# EAGLE schematic CC-16-2 ADIS16209 Breakout Board (EAGLE 9.2.2)
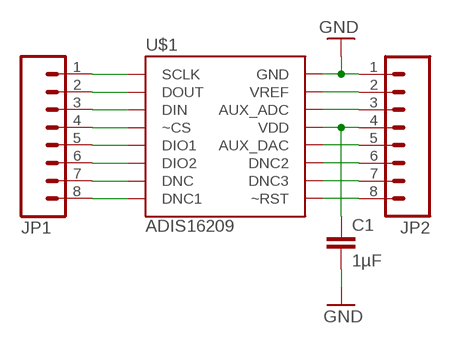
[diagram p0: schematic, sheet 1]

## Parts
C1  1µF  CAP0805  [0805]
JP1  M08  [1X08]
JP2  M08  [1X08]
U$1  ADIS16209  [CC-16-2]

## Nets
GND: C1.2 JP2.1 U$1.P$16(GND)
N$2: JP1.1 U$1.P$1(SCLK)
N$3: JP1.2 U$1.P$2(DOUT)
N$4: JP1.3 U$1.P$3(DIN)
N$5: JP1.4 U$1.P$4(~CS)
N$6: JP1.5 U$1.P$5(DIO1)
N$7: JP1.6 U$1.P$6(DIO2)
N$8: JP1.7 U$1.P$7(DNC)
N$9: JP1.8 U$1.P$8(DNC1)
N$10: JP2.2 U$1.P$15(VREF)
N$11: JP2.3 U$1.P$14(AUX_ADC)
N$12: C1.1 JP2.4 U$1.P$13(VDD)
N$13: JP2.5 U$1.P$12(AUX_DAC)
N$14: JP2.6 U$1.P$11(DNC2)
N$15: JP2.7 U$1.P$10(DNC3)
N$16: JP2.8 U$1.P$9(~RST)

## Library data of the parts
C1 = HyTechDevices:CAP: Capacitor Standard 0603 ceramic capacitor, and 0.1" leaded capacitor.
JP1 JP2 = HyTechDevices:M08: Standard 8-pin 0.1" header. NOTES ON THE VARIANTS LOCK and LOCK_LONGPADS... This footprint was designed to help hold the alignment of a through-hole component (i.e. 6-pin header) while soldering it into place. You may notice that each hole has been shifted either up or down by 0.005 of an inch from it's more standard position (which is a perfectly straight line). This slight alteration caused the pins (the squares in the middle) to touch the edges of the holes. Because they are alternating, it causes a "brace" to hold the component in place. 0.005 has proven to be the perfect amount of "off-center" position when using our standard breakaway headers. Although looks a little odd when you look at the bare footprint, once you have a header in there, the alteration is very hard to notice. Also,if you push a header all the way into place, it is covered up entirely on the bottom side. This idea of altering the position of holes to aid alignment will be further integrated into the Sparkfun Library for other footprints. It can help hold any component with 3 or more connection pins. Note: The Sparkfun version includes many other packages including surface mount that may be of future interest. Source: Sparkfun <https://github.com/sparkfun/SparkFun-Eagle-Libraries>
U$1 = HyTechDevices:ADIS16209